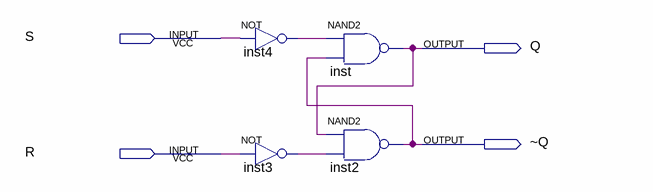
[diagram p0: schematic sheet]
// Quartus schematic lab9step3.bdf as structural Verilog: 4 symbols, 4 pins
module lab9step3 (
  input  S,
  input  R,
  output Q,
  output \~Q 
);

  wire inst3_out, inst4_out;

  not inst4 (inst4_out, S);
  not inst3 (inst3_out, R);
  nand inst (Q, inst4_out, \~Q );
  nand inst2 (\~Q , Q, inst3_out);
endmodule
